# Altium schematic sheet 02 ESP32 MAIN_B.SchDoc
size 420 x 297 mm
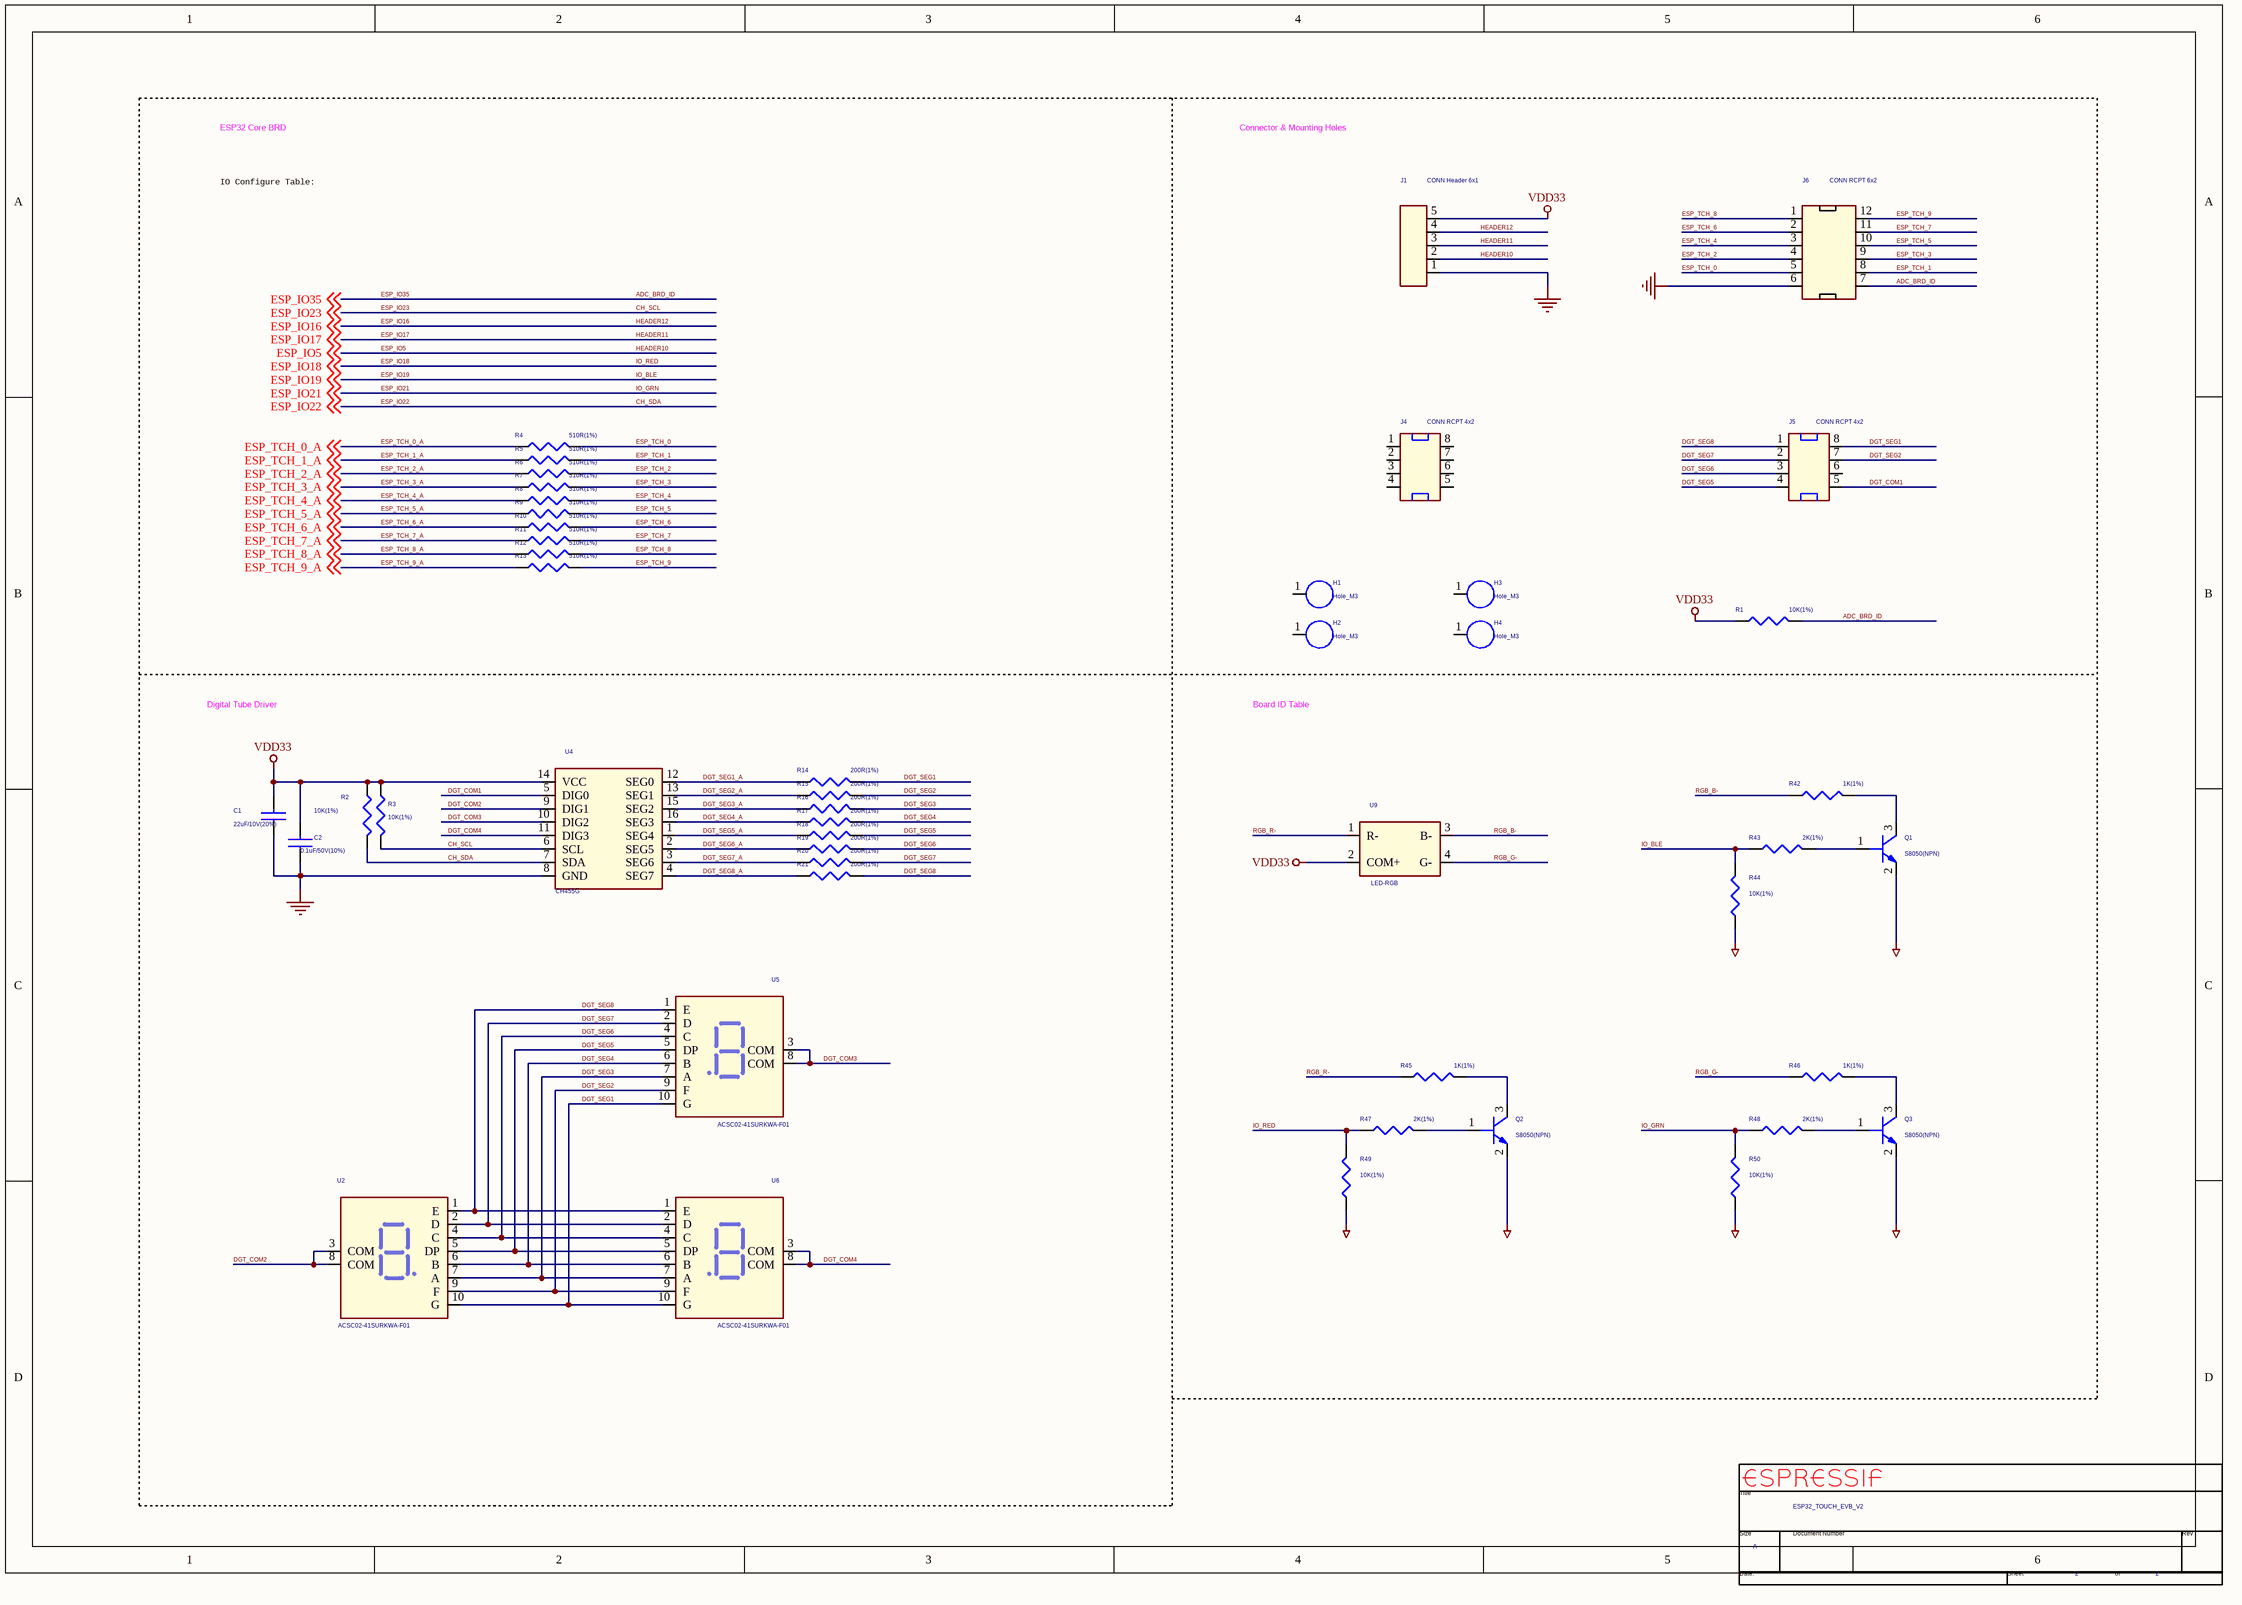
[diagram p0: 02 ESP32 MAIN_B.SchDoc]

## Parts
*  Title: ESP32_TOUCH_EVB_V2  Page Size: A  Page Number: 2  (hidden comment: espTitleBlock1)  (graphical)
C1  22uF/10V(20%)  [0603C]
C2  0.1uF/50V(10%)  [0402C]
H1  Hole_M3  [MTGH200C125D-N]
H2  Hole_M3  [MTGH200C125D-N]
H3  Hole_M3  [MTGH200C125D-N]
H4  Hole_M3  [MTGH200C125D-N]
J1  CONN Header 6x1  [CON_5x1_2P54]
J4  CONN RCPT 4x2  [CON_F_4x2_2P00]
J5  CONN RCPT 4x2  [CON_F_4x2_2P00]
J6  CONN RCPT 6x2  [CON_F_6x2_2P00]
Q1  S8050(NPN)  [SOT-23-3]
Q2  S8050(NPN)  [SOT-23-3]
Q3  S8050(NPN)  [SOT-23-3]
R1  10K(1%)  [0402R]
R2  10K(1%)  [0402R]
R3  10K(1%)  [0402R]
R4  510R(1%)  [0402R]
R5  510R(1%)  [0402R]
R6  510R(1%)  [0402R]
R7  510R(1%)  [0402R]
R8  510R(1%)  [0402R]
R9  510R(1%)  [0402R]
R10  510R(1%)  [0402R]
R11  510R(1%)  [0402R]
R12  510R(1%)  [0402R]
R13  510R(1%)  [0402R]
R14  200R(1%)  [0402R]
R15  200R(1%)  [0402R]
R16  200R(1%)  [0402R]
R17  200R(1%)  [0402R]
R18  200R(1%)  [0402R]
R19  200R(1%)  [0402R]
R20  200R(1%)  [0402R]
R21  200R(1%)  [0402R]
R42  1K(1%)  [0402R]
R43  2K(1%)  [0402R]
R44  10K(1%)  [0402R]
R45  1K(1%)  [0402R]
R46  1K(1%)  [0402R]
R47  2K(1%)  [0402R]
R48  2K(1%)  [0402R]
R49  10K(1%)  [0402R]
R50  10K(1%)  [0402R]
U2  ACSC02-41SURKWA-F01  [DG10069]
U4  CH455G  [SOP16-150MIL]
U5  ACSC02-41SURKWA-F01  [DG10069]
U6  ACSC02-41SURKWA-F01  [DG10069]
U9  LED-RGB  [LED3528]

## Nets
GND: C1.1 C2.1 J1.1 J6.6 Q1.2(E) Q2.2(E) Q3.2(E) R44.1 R49.1 R50.1 U4.8(GND)
VDD33: C1.2 C2.2 J1.5 R1.1 R2.1 R3.1 U4.14(VCC) U9.2(COM+)
ADC_BRD_ID: J6.7 R1.2 ; off-sheet ESP_IO35  [also labelled ESP_IO35]
CH_SCL: R3.2 U4.6(SCL) ; off-sheet ESP_IO23  [also labelled ESP_IO23]
CH_SDA: R2.2 U4.7(SDA) ; off-sheet ESP_IO22  [also labelled ESP_IO22]
DGT_COM1: J5.5 U4.5(DIG0)
DGT_COM2: U2.3(COM) U2.8(COM) U4.9(DIG1)
DGT_COM3: U4.10(DIG2) U5.3(COM) U5.8(COM)
DGT_COM4: U4.11(DIG3) U6.3(COM) U6.8(COM)
DGT_SEG1: J5.8 R14.2 U2.10(G) U5.10(G) U6.10(G)
DGT_SEG1_A: R14.1 U4.12(SEG0)
DGT_SEG2: J5.7 R15.2 U2.9(F) U5.9(F) U6.9(F)
DGT_SEG2_A: R15.1 U4.13(SEG1)
DGT_SEG3: R16.2 U2.7(A) U5.7(A) U6.7(A)
DGT_SEG3_A: R16.1 U4.15(SEG2)
DGT_SEG4: R17.2 U2.6(B) U5.6(B) U6.6(B)
DGT_SEG4_A: R17.1 U4.16(SEG3)
DGT_SEG5: J5.4 R18.2 U2.5(DP) U5.5(DP) U6.5(DP)
DGT_SEG5_A: R18.1 U4.1(SEG4)
DGT_SEG6: J5.3 R19.2 U2.4(C) U5.4(C) U6.4(C)
DGT_SEG6_A: R19.1 U4.2(SEG5)
DGT_SEG7: J5.2 R20.2 U2.2(D) U5.2(D) U6.2(D)
DGT_SEG7_A: R20.1 U4.3(SEG6)
DGT_SEG8: J5.1 R21.2 U2.1(E) U5.1(E) U6.1(E)
DGT_SEG8_A: R21.1 U4.4(SEG7)
ESP_IO5: J1.2 ; off-sheet ESP_IO5  [also labelled HEADER10]
ESP_IO16: J1.4 ; off-sheet ESP_IO16  [also labelled HEADER12]
ESP_IO17: J1.3 ; off-sheet ESP_IO17  [also labelled HEADER11]
ESP_IO18: R47.1 R49.2 ; off-sheet ESP_IO18  [also labelled IO_RED]
ESP_IO19: R43.1 R44.2 ; off-sheet ESP_IO19  [also labelled IO_BLE]
ESP_IO21: R48.1 R50.2 ; off-sheet ESP_IO21  [also labelled IO_GRN]
ESP_TCH_0: J6.5 R4.2
ESP_TCH_0_A: R4.1 ; off-sheet ESP_TCH_0_A
ESP_TCH_1: J6.8 R5.2
ESP_TCH_1_A: R5.1 ; off-sheet ESP_TCH_1_A
ESP_TCH_2: J6.4 R6.2
ESP_TCH_2_A: R6.1 ; off-sheet ESP_TCH_2_A
ESP_TCH_3: J6.9 R7.2
ESP_TCH_3_A: R7.1 ; off-sheet ESP_TCH_3_A
ESP_TCH_4: J6.3 R8.2
ESP_TCH_4_A: R8.1 ; off-sheet ESP_TCH_4_A
ESP_TCH_5: J6.10 R9.2
ESP_TCH_5_A: R9.1 ; off-sheet ESP_TCH_5_A
ESP_TCH_6: J6.2 R10.2
ESP_TCH_6_A: R10.1 ; off-sheet ESP_TCH_6_A
ESP_TCH_7: J6.11 R11.2
ESP_TCH_7_A: R11.1 ; off-sheet ESP_TCH_7_A
ESP_TCH_8: J6.1 R12.2
ESP_TCH_8_A: R12.1 ; off-sheet ESP_TCH_8_A
ESP_TCH_9: J6.12 R13.2
ESP_TCH_9_A: R13.1 ; off-sheet ESP_TCH_9_A
RGB_B-: R42.1 U9.3(B-)
RGB_G-: R46.1 U9.4(G-)
RGB_R-: R45.1 U9.1(R-)
NetQ1_1: Q1.1(B) R43.2
NetQ1_3: Q1.3(C) R42.2
NetQ2_1: Q2.1(B) R47.2
NetQ2_3: Q2.3(C) R45.2
NetQ3_1: Q3.1(B) R48.2
NetQ3_3: Q3.3(C) R46.2

Not connected (* = marked no-connect by the designer): H1 1; H2 1; H3 1; H4 1; J4 1 2 3 4 5 6 7 8; J5 6

## Notes on the sheet
- IO Configure Table:
- ESP32 Core BRD
- Connector & Mounting Holes
- Digital Tube Driver
- Board ID Table
- (in symbol espTitleBlock1) Title; Size; Document Number; Rev; Date:; Sheet; of

## Library data of the parts
C1 C2 = CAP NP
H1-H4 = CON1_0
J1 = 12 HEADER_12
J4 J5 = 12 HEADER_5
J6 = CONN RCPT 10x2_2
Q1-Q3 = NPN BCE_0: PspiceTemplate: Q^@REFDES %C %B %E
R1 R4-R21 R43 R47 R48 = RESISTOR
R2 R3 R42 R45 R46 = RESISTOR_0
R44 R49 R50 = RESISTOR_0: SIGNAL_MODEL: DEFAULT_RESISTOR_10000OHM_1_2
U2 U5 U6 = Digital_Tube: Part Number: ACSC02-41SURKWA-F01
U4 = 74HC138_4
* = espTitleBlock1: Page Create Date: March  8, 1995; Page Count: 2